# EAGLE board Replicape_B3 (EAGLE 7.2.0), part 1 of 2
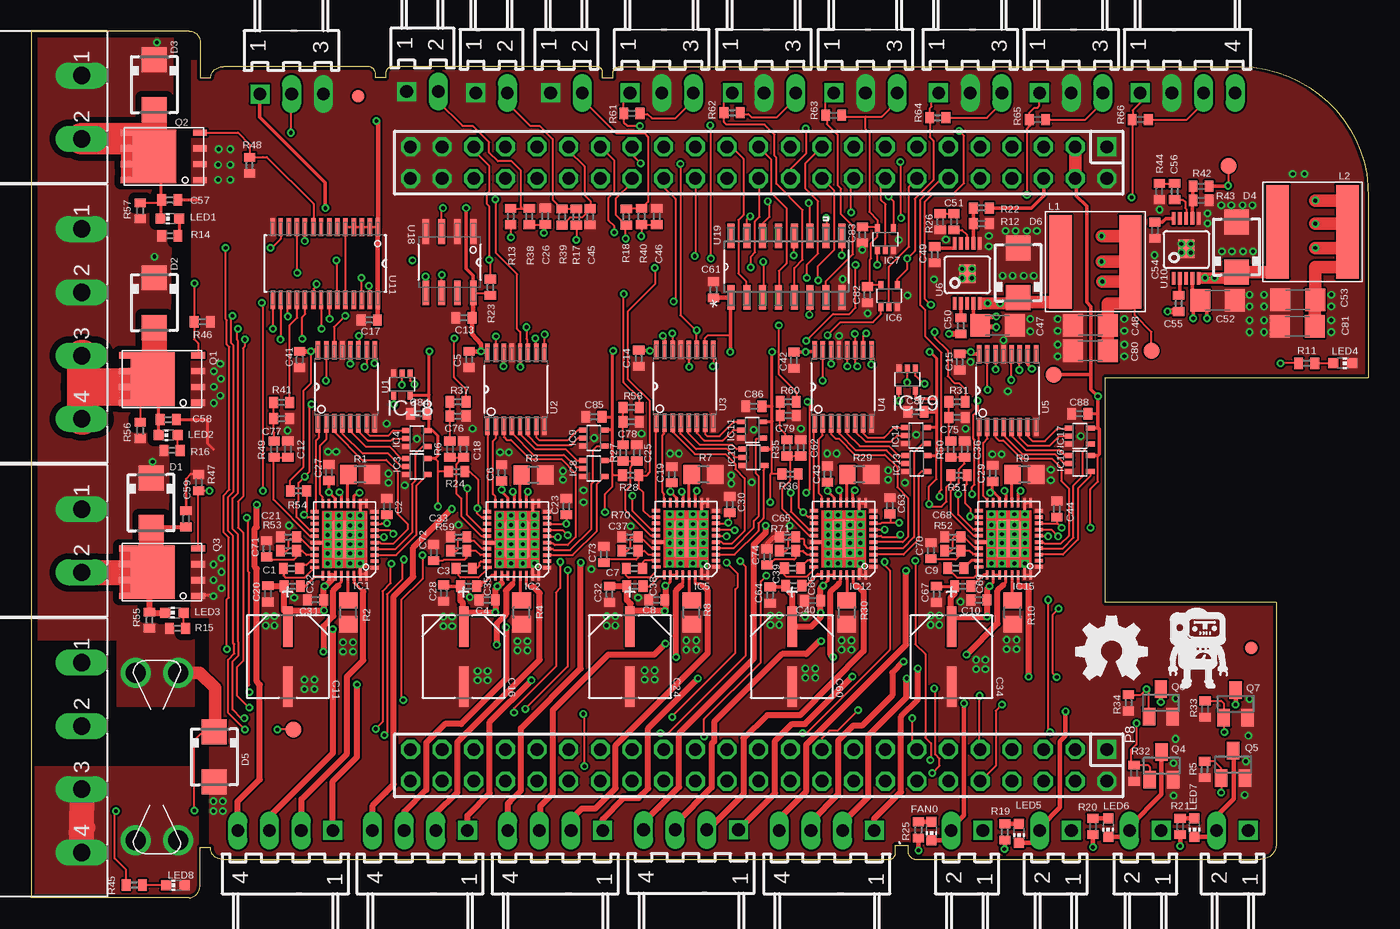
[diagram p5: board, top side]
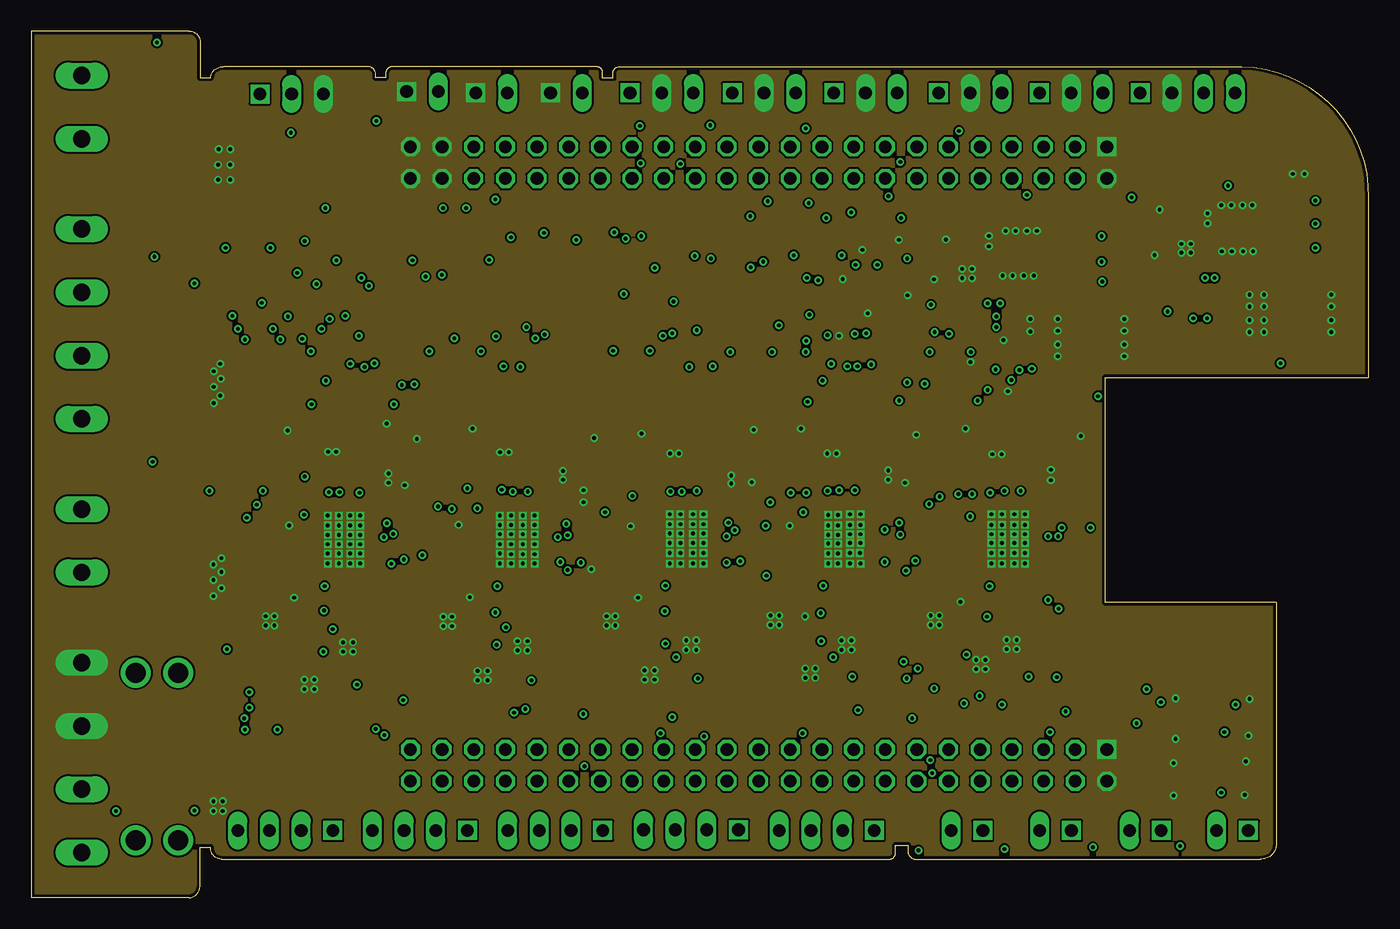
[diagram p6: board, inner layer GND]
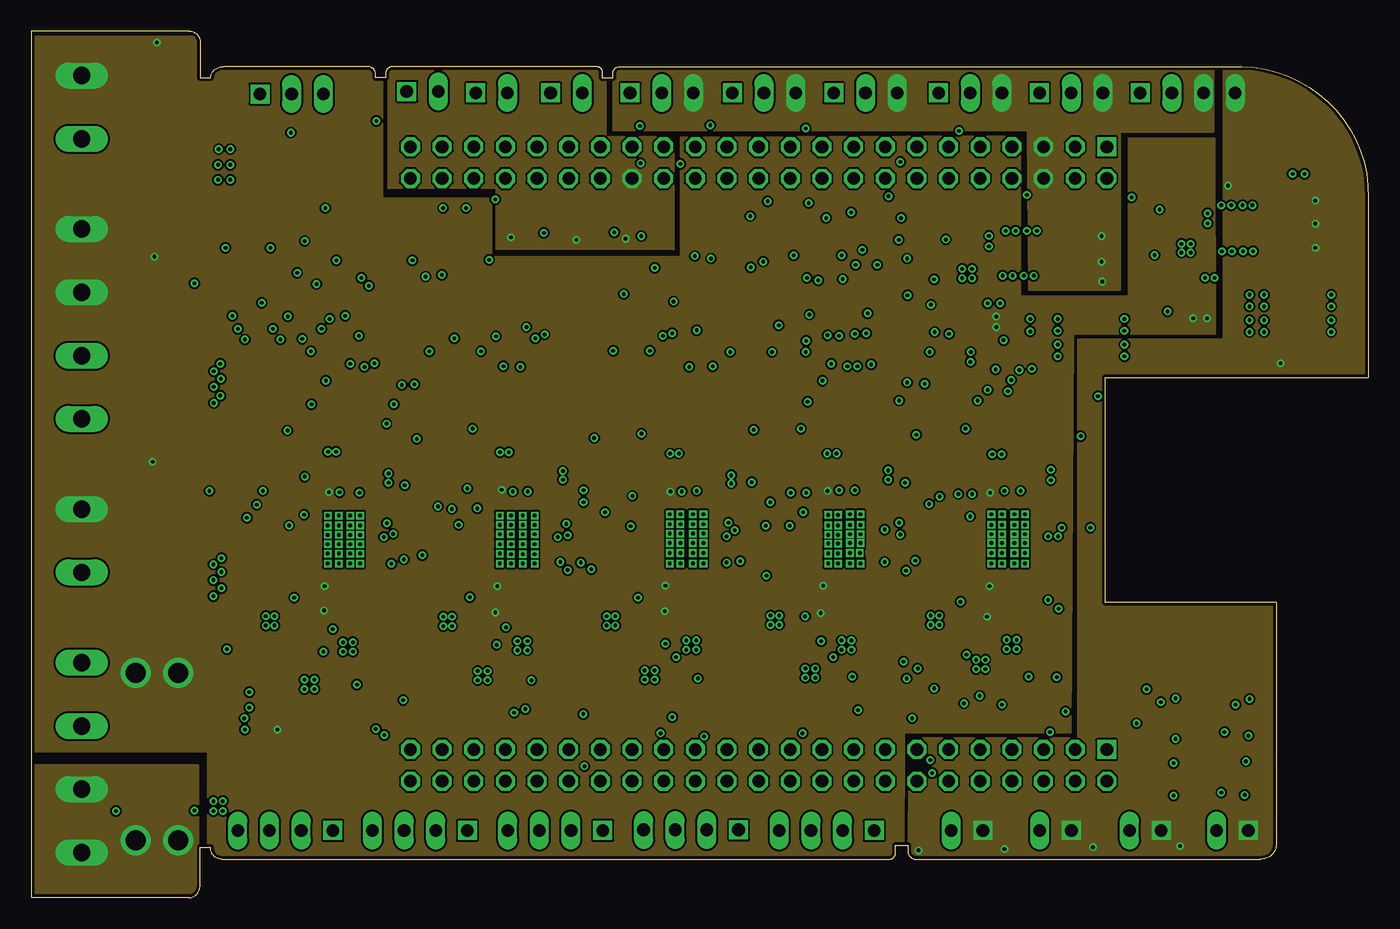
[diagram p7: board, inner layer VCC]
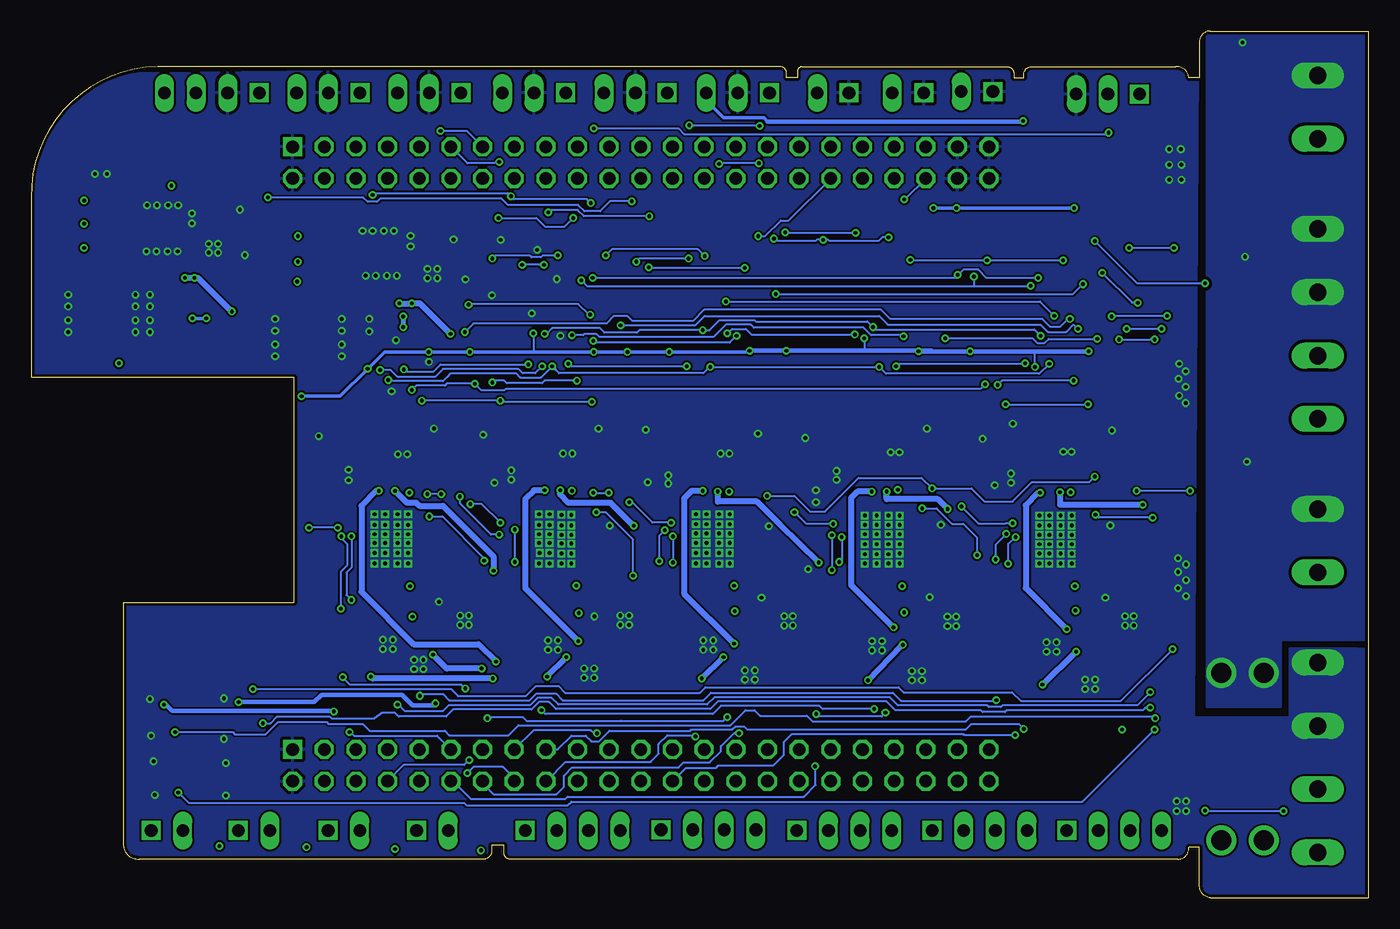
[diagram p8: board, bottom side, seen from below]

Size 107.3 x 69.55 mm. Coordinates in mm from the lower left corner, seen from the top.
Outline: 13.55,4.05 14.4,4.05 14.4,3.95 arc90 15.3,3.1 68.95,3.1 arc90 69.35,3.65 69.35,4.2 70.35,4.2 70.35,3.75 arc90 70.95,3.1 98.65,3.1 arc90 99.9,4.2 99.9,23.7 86.19,23.7 86.19,41.75 107.3,41.75 107.3,56.2 arc90 97.15,66.7 47.17,66.7 arc90 46.67,66.15 46.67,65.8 45.8,65.8 45.8,66.3 arc90 45.45,66.7 29,66.7 arc90 28.45,66.2 28.45,65.8 27.65,65.8 27.65,66.05 arc90 27.05,66.7 15.45,66.7 arc90 14.4,65.8 13.55,65.8 13.55,68.75 arc90 12.7,69.55 0,69.55 0,0 12.7,0 arc90 13.55,1.05 13.55,4.05
Copper layers (1*2*3*16): Top 0.035mm / dielectric 0.2mm / GND 0.035mm / dielectric 1.1mm / VCC 0.035mm / dielectric 0.2mm / Bottom 0.035mm
Design rules "default *": minimum track width 6mil, minimum drill 0.3mm, track to track 6mil, track to pad 6mil, pad to pad 6mil, via to via 6mil, smd to smd 0mil, copper to edge 10mil, drill to drill 10mil, minimum pad ring 10mil, minimum via ring 6mil, stop-mask expansion 2mil, vias tented up to drill 100mil, thermal gap 10mil
Net classes: 1 power: width 1.27 mm

## Footprints (pad centres in the part's own frame; a part is rotated, then mirrored left to right if it is on the bottom)
B1,27 = smd 1.27 x 1.27: TP 0,0
C0402 = smd 0.7 x 0.9: 1 -0.65,0; 2 0.65,0
CAPAE660X800N = smd 3.251 x 0.762: 1 -2.413,0; 2 2.413,0
C1206 = smd 1.6 x 1.8: 1 -1.4,0; 2 1.4,0
SMA = smd 2 x 2: A 2,0; C -2,0
3557 = drill 1.6: P$1 -6.73,1.7; P$2 -6.73,-1.7; P$3 6.73,-1.7; P$4 6.73,1.7
CHIP-LED0603 = smd 0.8 x 0.8: A 0,-0.75; C 0,0.75
QFN36-PAD = smd 0.7 x 0.25: 1 -2.4,2.25; 2 -2.4,1.75; 3 -2.4,1.25; 4 -2.4,0.75; 5 -2.4,0.25; 6 -2.4,-0.25; 7 -2.4,-0.75; 8 -2.4,-1.25; 9 -2.4,-1.75; 10 -2.4,-2.25; 19 2.4,-2.25; 20 2.4,-1.75; 21 2.4,-1.25; 22 2.4,-0.75; 23 2.4,-0.25; 25 2.4,0.75; 26 2.4,1.25; 27 2.4,1.75; 28 2.4,2.25 | smd 0.25 x 0.7: 11 -1.75,-2.9; 13 -0.75,-2.9; 14 -0.25,-2.9; 15 0.25,-2.9; 16 0.75,-2.9; 17 1.25,-2.9; 18 1.75,-2.9; 29 1.75,2.9; 30 1.25,2.9; 31 0.75,2.9; 32 0.25,2.9; 33 -0.25,2.9; 34 -0.75,2.9; 36 -1.75,2.9 | smd 0.25 x 1: 12 -1.25,-2.75; 35 -1.25,2.75 | smd 1 x 0.25: 24 2.25,0.25 | smd 2 x 3: TP 0,0
SC70-5 = smd 0.4 x 0.7: 1 -0.65,-0.85; 2 0,-0.85; 3 0.65,-0.85; 4 0.65,0.85; 5 -0.65,0.85
FIDUCIAL-1X2.5 = smd 1 x 1: 1 0,0
NR8040T330 = smd 1.8 x 7.5: P$1 2.8,0; P$2 -2.8,0
DIL-100-2X23 = drill 1.016 square: 1 -27.94,-1.27 | drill 1.016 octagon: 2 -27.94,1.27; 3 -25.4,-1.27; 4 -25.4,1.27; 5 -22.86,-1.27; 6 -22.86,1.27; 7 -20.32,-1.27; 8 -20.32,1.27; 9 -17.78,-1.27; 10 -17.78,1.27; 11 -15.24,-1.27; 12 -15.24,1.27; 13 -12.7,-1.27; 14 -12.7,1.27; 15 -10.16,-1.27; 16 -10.16,1.27; 17 -7.62,-1.27; 18 -7.62,1.27; 19 -5.08,-1.27; 20 -5.08,1.27; 21 -2.54,-1.27; 22 -2.54,1.27; 23 0,-1.27; 24 0,1.27; 25 2.54,-1.27; 26 2.54,1.27; 27 5.08,-1.27; 28 5.08,1.27; 29 7.62,-1.27; 30 7.62,1.27; 31 10.16,-1.27; 32 10.16,1.27; 33 12.7,-1.27; 34 12.7,1.27; 35 15.24,-1.27; 36 15.24,1.27; 37 17.78,-1.27; 38 17.78,1.27; 39 20.32,-1.27; 40 20.32,1.27; 41 22.86,-1.27; 42 22.86,1.27; 43 25.4,-1.27; 44 25.4,1.27; 45 27.94,-1.27; 46 27.94,1.27
8-DFN-EP-(5X6) = smd 1.1 x 0.5: 1 -2.9,1.905; 2 -2.9,0.635; 3 -2.9,-0.635; 4 -2.9,-1.905; 5 2.9,-1.905; 6 2.9,-0.635; 7 2.9,0.635; 8 2.9,1.905 | smd 3.5 x 4.3: TH 0.75,0
SOT23 = smd 1 x 1.4: 1 -0.95,-1.1; 2 0.95,-1.1; 3 0,1.1
R0805 = smd 1.3 x 1.5: 1 -0.95,0; 2 0.95,0
R0402 = smd 0.7 x 0.9: 1 -0.65,0; 2 0.65,0
SOP65P640X120-16N = smd 1.473 x 0.356: 1 -2.921,2.286; 2 -2.921,1.626; 3 -2.921,0.965; 4 -2.921,0.33; 5 -2.921,-0.33; 6 -2.921,-0.965; 7 -2.921,-1.626; 8 -2.921,-2.286; 9 2.921,-2.286; 10 2.921,-1.626; 11 2.921,-0.965; 12 2.921,-0.33; 13 2.921,0.33; 14 2.921,0.965; 15 2.921,1.626; 16 2.921,2.286
MSOP10 = smd 0.3 x 1: 1 -1,-2.4; 2 -0.5,-2.4; 3 0.005,-2.4; 4 0.5,-2.4; 5 1,-2.4; 6 1,2.4; 7 0.5,2.4; 8 0.005,2.4; 9 -0.5,2.4; 10 -1,2.4 | smd 1.3 x 1.5: EP 0.02,-0.04
SOP65P640X110-28N = smd 1.473 x 0.356: 1 -2.921,4.216; 2 -2.921,3.581; 3 -2.921,2.921; 4 -2.921,2.286; 5 -2.921,1.626; 6 -2.921,0.965; 7 -2.921,0.33; 8 -2.921,-0.33; 9 -2.921,-0.965; 10 -2.921,-1.626; 11 -2.921,-2.286; 12 -2.921,-2.921; 13 -2.921,-3.581; 14 -2.921,-4.216; 15 2.921,-4.216; 16 2.921,-3.581; 17 2.921,-2.921; 18 2.921,-2.286; 19 2.921,-1.626; 20 2.921,-0.965; 21 2.921,-0.33; 22 2.921,0.33; 23 2.921,0.965; 24 2.921,1.626; 25 2.921,2.286; 26 2.921,2.921; 27 2.921,3.581; 28 2.921,4.216
SOIC127P600X175-8N = smd 1.981 x 0.533: 1 -2.464,1.905; 2 -2.464,0.635; 3 -2.464,-0.635; 4 -2.464,-1.905; 5 2.464,-1.905; 6 2.464,-0.635; 7 2.464,0.635; 8 2.464,1.905
SOIC127P600X175-16N = smd 1.981 x 0.559: 1 -2.464,4.445; 2 -2.464,3.175; 3 -2.464,1.905; 4 -2.464,0.635; 5 -2.464,-0.635; 6 -2.464,-1.905; 7 -2.464,-3.175; 8 -2.464,-4.445; 9 2.464,-4.445; 10 2.464,-3.175; 11 2.464,-1.905; 12 2.464,-0.635; 13 2.464,0.635; 14 2.464,1.905; 15 2.464,3.175; 16 2.464,4.445
7395-03 = drill 1.016 square: 1 2.54,0 | drill 1.016 long: 2 0,0; 3 -2.54,0
MSTBA4 = drill 1.397 long: 1 -7.62,5.08; 2 -2.54,5.08; 3 2.54,5.08; 4 7.62,5.08
MSTBA2 = drill 1.397 long: 1 -2.54,5.08; 2 2.54,5.08
7395-02 = drill 1.016 square: 1 1.27,0 | drill 1.016 long: 2 -1.27,0
7395-04 = drill 1.016 square: 1 3.81,0 | drill 1.016 long: 2 1.27,0; 3 -1.27,0; 4 -3.81,0

## Placement (x,y rotation side)
3.3V  TPB1,27  [B1,27]  82.05,41.98 0 top
5V  TPB1,27  [B1,27]  89.9,43.9 270 top
12..24V  TPB1,27  [B1,27]  21.05,13.5 90 top
12V  TPB1,27  [B1,27]  96.08,58.75 90 top
C1  22nF  [C0402]  20.89,26.43 0 top
C2  0.1uF  [C0402]  28.55,31.4 90 top
C3  22nF  [C0402]  34.75,26.43 0 top
C4  0.1uF  [C0402]  36.6,23.9 180 top
C5  0.1uF  [C0402]  35.15,43.2 270 top
C6  0.1uF  [C0402]  37.75,34.1 90 top
C7  22nF  [C0402]  48.4,26.43 0 top
C8  0.1uF  [C0402]  50.2,23.9 180 top
C9  22nF  [C0402]  74.2,26.45 0 top
C10  0.1uF  [C0402]  76.05,23.9 180 top
C11  100UF  [CAPAE660X800N]  20.6,19.35 270 top
C12  4.7uF  [C0402]  20.6,36 90 top
C13  0.1uF  [C0402]  34.73,46.55 180 top
C14  0.1uF  [C0402]  48.75,43.3 270 top
C15  0.1uF  [C0402]  74.5,43 270 top
C16  100UF  [CAPAE660X800N]  34.7,19.35 270 top
C17  0.1uF  [C0402]  27.13,46.37 180 top
C18  4.7uF  [C0402]  34.7,36 90 top
C19  0.1uF  [C0402]  51.4,33.95 90 top
C20  0.1uF  [C0402]  19,24.4 90 top
C21  4.7uF  [C0402]  20.65,28.95 0 top
C22  0.1uF  [C0402]  20.95,25 180 top
C23  0.1uF  [C0402]  42.95,31.4 90 top
C24  100UF  [CAPAE660X800N]  48.05,19.35 270 top
C25  4.7uF  [C0402]  48.6,35.7 90 top
C26  4.7uF  [C0402]  41.25,54.7 90 top
C27  0.1uF  [C0402]  23.89,34.13 90 top
C28  0.1uF  [C0402]  33.1,24.45 90 top
C29  0.1uF  [C0402]  77.15,34.05 90 top
C30  0.1uF  [C0402]  56.05,31.55 90 top
C31  0.1uF  [C0402]  22.83,23.91 180 top
C32  0.1uF  [C0402]  46.4,24.35 90 top
C33  4.7uF  [C0402]  34.3,28.95 0 top
C34  100UF  [CAPAE660X800N]  73.85,19.35 270 top
C35  0.1uF  [C0402]  35.1,25 180 top
C36  4.7uF  [C0402]  74.9,36 90 top
C37  4.7uF  [C0402]  48.05,28.95 0 top
C38  0.1uF  [C0402]  48.45,25 180 top
C39  22nF  [C0402]  61.1,26.45 0 top
C40  0.1uF  [C0402]  62.7,23.85 180 top
C41  0.1uF  [C0402]  21.55,43.19 270 top
C42  0.1uF  [C0402]  61.2,43.15 270 top
C43  0.1uF  [C0402]  63.9,34 90 top
C44  0.1uF  [C0402]  82.3,31.2 90 top
C45  4.7uF  [C0402]  44.85,54.65 270 top
C46  4.7uF  [C0402]  50.2,54.67 90 top
C47  10uF  [C1206]  77.55,45.95 0 top
C48  10uF  [C1206]  85,45.95 180 top
C49  10nF  [C0402]  72.5,51.6 270 top
C50  10nF  [C0402]  74.6,45.9 270 top
C51  1nF  [C0402]  74.05,54.25 90 top
C52  10uF  [C1206]  95.2,47.95 0 top
C53  10uF  [C1206]  101.62,47.98 180 top
C54  10nF  [C0402]  90.17,53.58 270 top
C55  10nF  [C0402]  92.08,47.7 270 top
C56  1nF  [C0402]  91.75,56.67 90 top
C57  4.7nF  [C0402]  11.12,56 0 top
C58  4.7nF  [C0402]  11,38.38 0 top
C59  4.7nF  [C0402]  12.43,30.4 90 top
C60  100UF  [CAPAE660X800N]  61.05,19.35 270 top
C61  0.1uF  [C0402]  54.75,48.8 90 top
C62  4.7uF  [C0402]  61.75,36.1 90 top
C63  0.1uF  [C0402]  68.9,31.45 90 top
C64  0.1uF  [C0402]  59.3,24.3 90 top
C65  4.7uF  [C0402]  60.7,28.95 0 top
C66  0.1uF  [C0402]  61.2,25.05 180 top
C67  0.1uF  [C0402]  72.65,24.35 90 top
C68  4.7uF  [C0402]  73.95,28.95 0 top
C69  0.1uF  [C0402]  74.75,25 180 top
C70  0.1uF  [C0402]  72.2,27.85 90 top
C71  0.1uF  [C0402]  18.9,28 90 top
C72  0.1uF  [C0402]  32.3,27.7 90 top
C73  0.1uF  [C0402]  45.95,27.55 90 top
C74  0.1uF  [C0402]  59.05,27.35 90 top
C75  4.7uF  [C0402]  74.3,38.55 0 top
C76  4.7uF  [C0402]  34.25,38.65 0 top
C77  4.7uF  [C0402]  20.1,38.45 0 top
C78  4.7uF  [C0402]  48.15,38.2 0 top
C79  4.7uF  [C0402]  60.75,38.7 0 top
C80  10uF  [C1206]  85,43.9 180 top
C81  10uF  [C1206]  101.6,45.85 180 top
C82  0.1uF  [C0402]  67.1,48.4 270 top
C83  0.1uF  [C0402]  66.7,53.2 270 top
C84  0.1uF  [C0402]  31.1,38.85 180 top
C85  0.1uF  [C0402]  45.15,38.6 180 top
C86  0.1uF  [C0402]  58,39.45 180 top
C87  0.1uF  [C0402]  71,39 180 top
C88  0.1uF  [C0402]  84.15,38.85 180 top
D1  MBRA340T3  [SMA]  9.62,31.7 270 top
D2  MBRA340T3  [SMA]  9.88,47.75 270 top
D3  MBRA340T3  [SMA]  9.88,65.25 270 top
D4  MBRA340T3  [SMA]  96.72,52.23 90 top
D5  MBRA340T3  [SMA]  14.7,11.3 270 top
D6  MBRA340T3  [SMA]  79.2,50.15 90 top
F1  FUSE  [3557]  10.1,11.33 90 top
FAN0  blue  [CHIP-LED0603]  72.25,5.35 180 top
IC1  TMC2100-LA  [QFN36-PAD]  25.15,28.75 180 top
IC2  TMC2100-LA  [QFN36-PAD]  39,28.75 180 top
IC3  74AHC1G126DCK  [SC70-5]  30.95,34.6 270 top
IC4  74AHC1G126DCK  [SC70-5]  30.95,36.85 270 top
IC5  TMC2100-LA  [QFN36-PAD]  52.55,28.8 180 top
IC6  74AHC1G126DCK  [SC70-5]  68.85,48.3 0 top
IC7  74AHC1G126DCK  [SC70-5]  68.55,52.85 0 top
IC8  74AHC1G126DCK  [SC70-5]  45.15,34.45 270 top
IC9  74AHC1G126DCK  [SC70-5]  45.15,36.9 270 top
IC10  74AHC1G126DCK  [SC70-5]  57.95,35.35 270 top
IC11  74AHC1G126DCK  [SC70-5]  57.85,37.55 270 top
IC12  TMC2100-LA  [QFN36-PAD]  65.2,28.8 180 top
IC13  74AHC1G126DCK  [SC70-5]  71.05,34.85 270 top
IC14  74AHC1G126DCK  [SC70-5]  71,37.1 270 top
IC15  TMC2100-LA  [QFN36-PAD]  78.45,28.8 180 top
IC16  74AHC1G126DCK  [SC70-5]  84.15,34.85 270 top
IC17  74AHC1G126DCK  [SC70-5]  84.15,37.05 270 top
IC18  74AHC1G126DCK  [SC70-5]  29.75,41.2 180 top
IC19  74AHC1G126DCK  [SC70-5]  70.3,41.6 180 top
JP1  FIDUCIAL1X2.5  [FIDUCIAL-1X2.5]  26.23,64.33 0 top
JP2  FIDUCIAL1X2.5  [FIDUCIAL-1X2.5]  97.9,20.05 0 top
L1  33uH  [NR8040T330]  85.4,51.05 0 top
L2  33uH  [NR8040T330]  102.83,53.45 0 top
LED1  blue  [CHIP-LED0603]  11.12,54.5 90 top
LED2  blue  [CHIP-LED0603]  11,37.12 90 top
LED3  blue  [CHIP-LED0603]  11.5,22.88 90 top
LED4  blue  [CHIP-LED0603]  105.25,42.9 270 top
LED5  blue  [CHIP-LED0603]  79.28,5.17 180 top
LED6  blue  [CHIP-LED0603]  86.42,5.62 180 top
LED7  blue  [CHIP-LED0603]  93.35,5.62 180 top
LED8  blue  [CHIP-LED0603]  11.57,1 90 top
LOGO1  OSHW_LOGO_FILLX0200-NT  [OSHW_FILLX200_NOTEXT]  83.86,17.51 0 top
P8  F-2X23-  [DIL-100-2X23]  58.38,10.62 180 top
P9  F-2X23-  [DIL-100-2X23]  58.38,59 180 top
Q1  AON6758  [8-DFN-EP-(5X6)]  10.5,41.62 180 top
Q2  AON6758  [8-DFN-EP-(5X6)]  10.65,59.5 180 top
Q3  AON6758  [8-DFN-EP-(5X6)]  10.5,26.12 180 top
Q4  [SOT23]  90.7,10.6 0 top
Q5  [SOT23]  96.45,10.7 0 top
Q6  [SOT23]  90.65,15.65 0 top
Q7  [SOT23]  96.65,15.55 0 top
R1  0.1R  [R0805]  26.4,33.98 180 top
R2  0.1R  [R0805]  25.45,22.9 90 top
R3  0.1R  [R0805]  40.3,33.92 180 top
R4  0.1R  [R0805]  39.35,22.9 90 top
R5  4.7K  [R0402]  94.15,10.3 90 top
R6  10K  [R0402]  33.6,36 90 top
R7  0.1R  [R0805]  53.95,33.98 180 top
R8  0.1R  [R0805]  53,22.9 90 top
R9  0.1R  [R0805]  79.7,33.98 180 top
R10  0.1R  [R0805]  78.75,22.9 90 top
R11  4.7K  [R0402]  102.35,42.9 180 top
R12  44.3K  [R0402]  76.25,55.35 180 top
R13  4K7, 1%  [R0402]  38.48,54.67 270 top
R14  4.7K  [R0402]  11.12,53.12 180 top
R15  4.7K  [R0402]  11.75,21.62 180 top
R16  4.7K  [R0402]  11.3,35.9 180 top
R17  4K7, 1%  [R0402]  43.75,54.62 270 top
R18  4K7, 1%  [R0402]  47.75,54.62 270 top
R19  4.7K  [R0402]  78.12,5.28 270 top
R20  4.7K  [R0402]  85.2,5.72 270 top
R21  4.7K  [R0402]  92.2,5.72 270 top
R22  10K  [R0402]  76.25,54.1 0 top
R23  4.7K  [R0402]  36.85,49 270 top
R24  4.7K  [R0402]  34.15,34.2 180 top
R25  4.7K  [R0402]  71.2,5.45 270 top
R26  39K  [R0402]  72.95,54.25 270 top
R27  10K  [R0402]  47.5,35.7 90 top
R28  4.7K  [R0402]  48.1,33.9 180 top
R29  0.1R  [R0805]  66.45,33.98 180 top
R30  0.1R  [R0805]  65.45,22.9 90 top
R31  10K  [R0402]  74.3,39.8 0 top
R32  4.7K  [R0402]  88.5,10 90 top
R33  4.7K  [R0402]  94.2,15.15 90 top
R34  4.7K  [R0402]  88.05,15.65 90 top
R35  10K  [R0402]  60.65,36.1 90 top
R36  4.7K  [R0402]  60.9,34 180 top
R37  10K  [R0402]  34.25,39.8 0 top
R38  10K  [R0402]  39.98,54.67 270 top
R39  10K  [R0402]  42.6,54.62 270 top
R40  10K  [R0402]  48.98,54.67 270 top
R41  10K  [R0402]  20.1,39.75 0 top
R42  120K  [R0402]  93.88,57.1 180 top
R43  10K  [R0402]  93.88,55.98 0 top
R44  39K  [R0402]  90.53,56.67 270 top
R45  4.7K  [R0402]  8.28,1.02 0 top
R46  4.7K  [R0402]  13.72,46.23 180 top
R47  4.7K  [R0402]  13.45,33.33 270 top
R48  4.7K  [R0402]  17.52,58.77 90 top
R49  10K  [R0402]  19.5,36 90 top
R50  10K  [R0402]  73.8,36 90 top
R51  4.7K  [R0402]  74.45,33.9 180 top
R52  2.2R  [R0402]  73.95,27.85 0 top
R53  2.2R  [R0402]  20.65,27.85 0 top
R54  4.7K  [R0402]  21.45,32.65 180 top
R55  4.7K  [R0402]  9.5,22.27 270 top
R56  4.7K  [R0402]  8.75,37.5 270 top
R57  4.7K  [R0402]  8.75,55.12 270 top
R58  10K  [R0402]  48.15,39.35 0 top
R59  2.2R  [R0402]  34.3,27.85 0 top
R60  10K  [R0402]  60.75,39.8 0 top
R61  4.7K  [R0402]  48.2,62.95 0 top
R62  4.7K  [R0402]  56.25,63 0 top
R63  4.7K  [R0402]  64.4,62.8 0 top
R64  4.7K  [R0402]  72.75,62.6 0 top
R65  4.7K  [R0402]  80.75,62.45 0 top
R66  4.7K  [R0402]  89,62.45 0 top
R70  2.2R  [R0402]  48.05,27.85 0 top
R71  2.2R  [R0402]  60.7,27.85 0 top
U1  SN74AHC595PW  [SOP65P640X120-16N]  25.3,41 90 top
U2  SN74AHC595PW  [SOP65P640X120-16N]  38.9,40.8 90 top
U3  SN74AHC595PW  [SOP65P640X120-16N]  52.45,41.05 90 top
U4  SN74AHC595PW  [SOP65P640X120-16N]  65.15,41 90 top
U5  SN74AHC595PW  [SOP65P640X120-16N]  78.35,40.7 90 top
U6  RT8268  [MSOP10]  75.1,50.1 0 top
U10  RT8268  [MSOP10]  92.67,52.12 0 top
U11  PCA9685PW  [SOP65P640X110-28N]  23.6,50.9 270 top
U18  CAT24C256  [SOIC127P600X175-8N]  33.58,51 270 top
U19  CD4050BD  [SOIC127P600X175-16N]  60.6,50.65 90 top
U$1  [LOGO_BIG]  93.2,20.1 0 top
U$4  CC-BY-SA  [CC-BY-SA]  23.65,57.9 0 top
X1  22-05-7038-03  [7395-03]  58.8,64.6 180 top
X2  MSTBA4  [MSTBA4]  -1.02,11.25 270 top
X3  MSTBA2  [MSTBA2]  -1.02,28.65 270 top
X4  22-05-7028-02  [7395-02]  82.2,5.4 0 top
X5  22-05-7028-02  [7395-02]  89.4,5.4 0 top
X6  22-05-7028-02  [7395-02]  96.4,5.4 0 top
X7  22-05-7028-02  [7395-02]  36.95,64.6 180 top
X8  22-05-7028-02  [7395-02]  31.4,64.7 180 top
X9  22-05-7028-02  [7395-02]  75.1,5.4 0 top
X10  22-05-7038-03  [7395-03]  75.35,64.6 180 top
X11  22-05-7028-02  [7395-02]  42.95,64.6 180 top
X12  22-05-7048-04  [7395-04]  92.8,64.6 180 top
X13  22-05-7038-03  [7395-03]  66.95,64.6 180 top
X14  22-05-7048-04  [7395-04]  20.4,5.4 0 top
X15  22-05-7048-04  [7395-04]  31.2,5.4 0 top
X16  22-05-7048-04  [7395-04]  42.05,5.4 0 top
X17  22-05-7048-04  [7395-04]  52.95,5.45 0 top
X18  22-05-7048-04  [7395-04]  63.85,5.4 0 top
X19  22-05-7038-03  [7395-03]  83.45,64.6 180 top
X20  MSTBA4  [MSTBA4]  -1.02,46.05 270 top
X21  MSTBA2  [MSTBA2]  -1.02,63.45 270 top
X22  22-05-7038-03  [7395-03]  50.6,64.6 180 top
X23  22-05-7038-03  [7395-03]  20.9,64.5 180 top